# EAGLE design STUSB4500 (EAGLE 9.5.2)
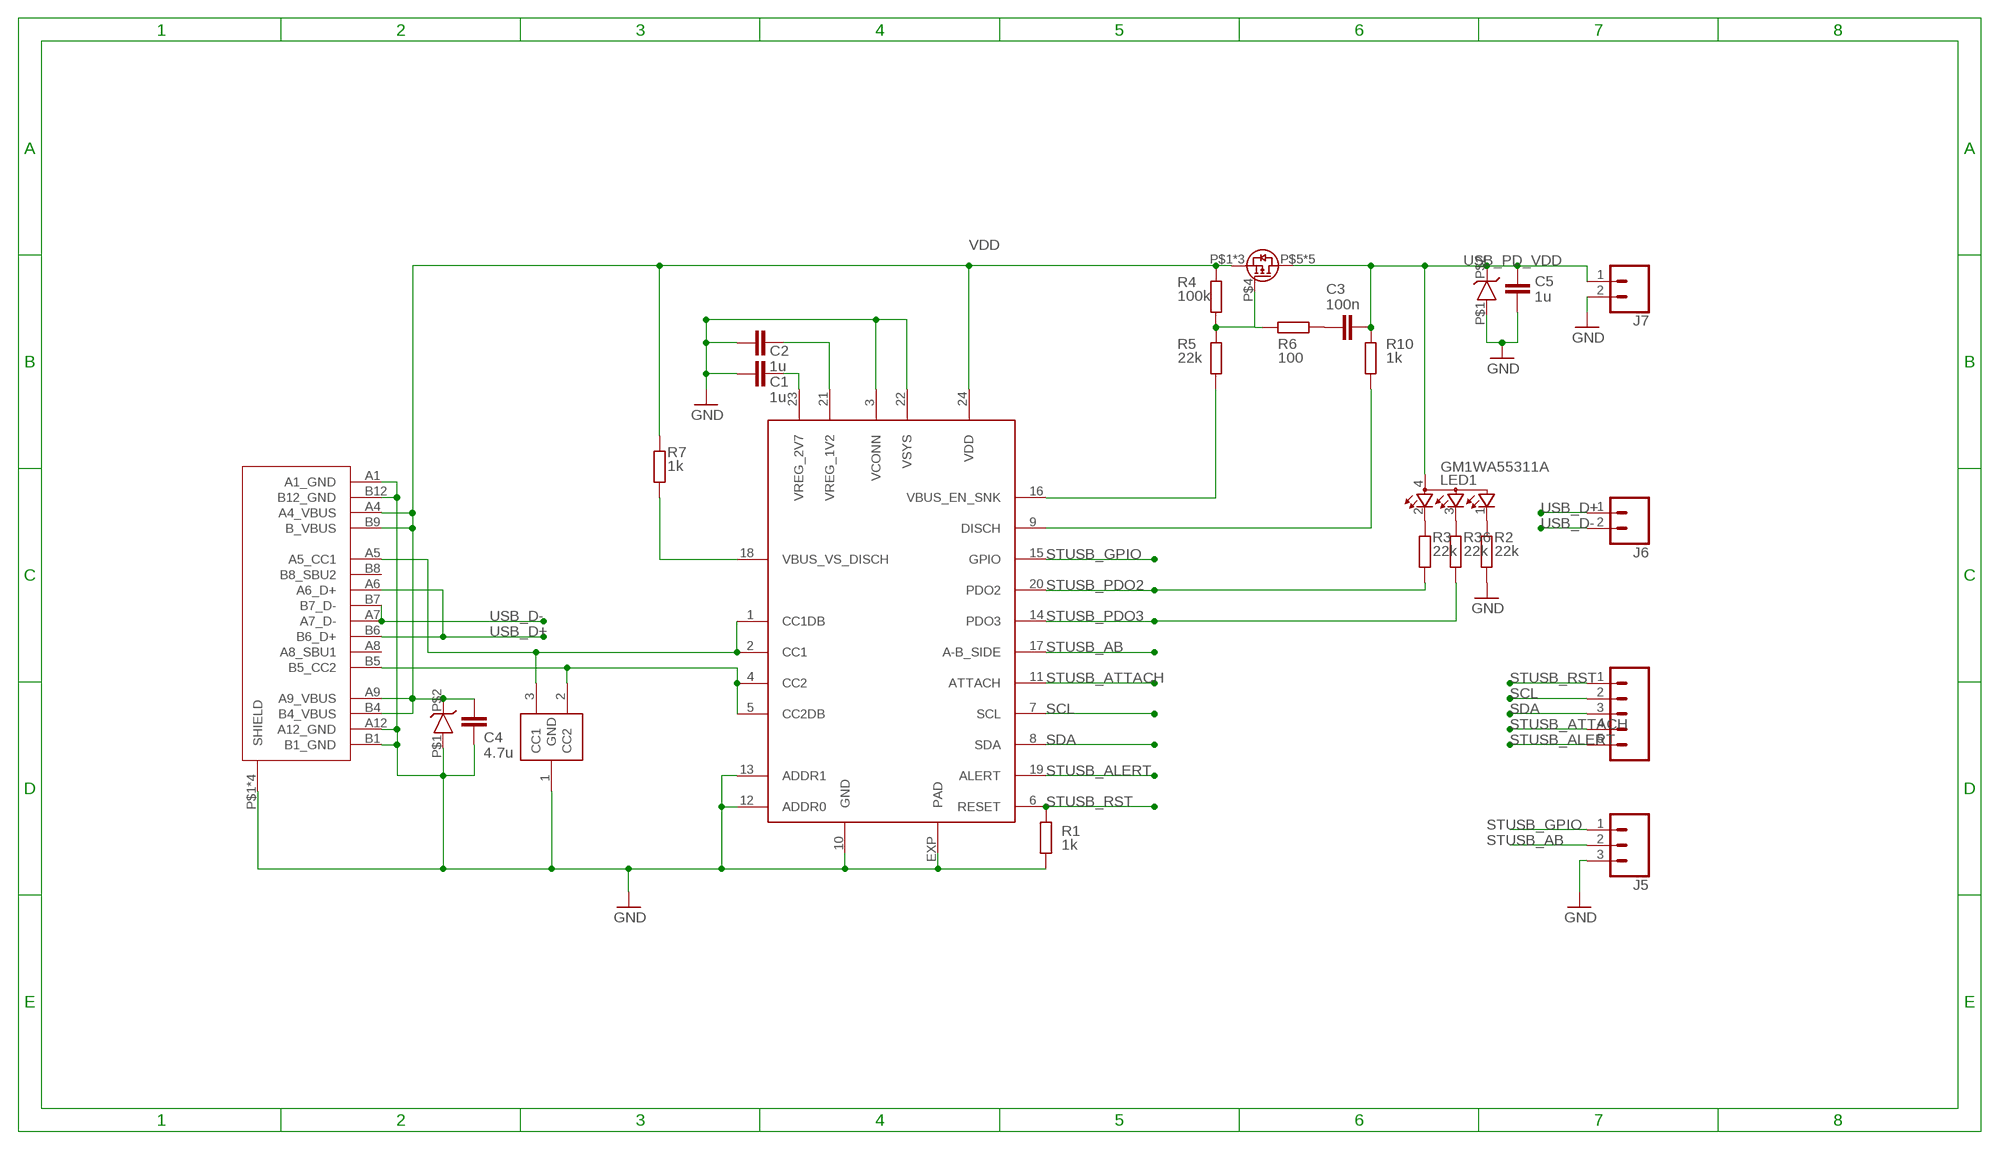
[diagram p0: schematic, sheet 1]

## Parts
C1  1u  C-EUC0402  [C0402]
C2  1u  C-EUC0402  [C0402]
C3  100n  C-EUC0402  [C0402]
C4  4.7u  C-EUC1206  [C1206]
C5  1u  C-EUC1206  [C1206]
ESDA25W  ESDA25WSOT323  [SOT323]
J5  CONN_031.27  [1X03_1.27MM]
J6  CONN_021.27  [1X02_1.27MM]
J7  CONN_02LOCK  [1X02_LOCK]
J8  CONN_051.27MM  [1X05_1.27MM]
LED1  GM1WA55311A  [GM1WA55311A]
R1  1k  R-EU_R0402  [R0402]
R2  22k  R-EU_R0402  [R0402]
R3  22k  R-EU_R0402  [R0402]
R4  100k  R-EU_R0402  [R0402]
R5  22k  R-EU_R0402  [R0402]
R6  100  R-EU_R0402  [R0402]
R7  1k  R-EU_R0402  [R0402]
R10  1k  R-EU_R0402  [R0402]
R36  22k  R-EU_R0402  [R0402]
U$1  STUSB4500QFN24_4X4  [QFN24-4X4]
U$2  USB-C  [USB-C_16P]
U$4  ESDA25P35  [1610]
U$5  ESDA25P35  [1610]
U$6  STL6P3LLH6  [POWER_FLAT_3X3]

## Nets
GND: C1.2 C2.2 C4.2 C5.2 ESDA25W.1(GND) J5.3 J7.2 R1.1 R2.1 U$1.3(VCONN) U$1.10(GND) U$1.12(ADDR0) U$1.13(ADDR1) U$1.22(VSYS) U$1.EXP(PAD) U$2.A1(A1_GND) U$2.A12(A12_GND) U$2.B1(B1_GND) U$2.B12(B12_GND) U$2.P$1(SHIELD) U$2.P$2(SHIELD) U$2.P$3(SHIELD) U$2.P$4(SHIELD) U$4.P$1(GND) U$5.P$1(GND)
N$2: LED1.1(CGREEN) R2.2
N$3: R4.1 R5.2 R6.2 U$6.P$4(G)
N$5: R7.2 U$1.18(VBUS_VS_DISCH)
N$6: LED1.2(CRED) R3.2
N$7: C3.1 R6.1
N$10: ESDA25W.3(CC1) U$1.1(CC1DB) U$1.2(CC1) U$2.A5(A5_CC1)
N$11: ESDA25W.2(CC2) U$1.4(CC2) U$1.5(CC2DB) U$2.B5(B5_CC2)
N$12: R5.1 U$1.16(VBUS_EN_SNK)
N$14: R10.2 U$1.9(DISCH)
N$16: C1.1 U$1.23(VREG_2V7)
N$17: C2.1 U$1.21(VREG_1V2)
N$20: LED1.3(CBLUE) R36.2
SCL: J8.2 U$1.7(SCL)
SDA: J8.3 U$1.8(SDA)
STUSB_AB: J5.2 U$1.17(A-B_SIDE)
STUSB_ALERT: J8.5 U$1.19(ALERT)
STUSB_ATTACH: J8.4 U$1.11(ATTACH)
STUSB_GPIO: J5.1 U$1.15(GPIO)
STUSB_PDO2: R3.1 U$1.20(PDO2)
STUSB_PDO3: R36.1 U$1.14(PDO3)
STUSB_RST: J8.1 R1.2 U$1.6(RESET)
USB_D+: J6.1 U$2.A6(A6_D+) U$2.B6(B6_D+)
USB_D-: J6.2 U$2.A7(A7_D-) U$2.B7(B7_D-)
USB_PD_VDD: C3.2 C5.1 J7.1 LED1.4(A) R10.1 U$5.P$2(VBUS) U$6.P$5(D) U$6.P$6(D) U$6.P$7(D) U$6.P$8(D) U$6.P$9(D)
VDD: C4.1 R4.2 R7.1 U$1.24(VDD) U$2.A4(A4_VBUS) U$2.A9(A9_VBUS) U$2.B4(B4_VBUS) U$2.B9(B_VBUS) U$4.P$2(VBUS) U$6.P$1(S) U$6.P$2(S) U$6.P$3(S)
Unconnected: U$2.A8(A8_SBU1) U$2.B8(B8_SBU2)

## Library data of the parts
C1-C5 = DD_rcl:C-EU: CAPACITOR, European symbol; SPICEPREFIX: C
ESDA25W = DD_STUSB4500:ESDA25W
J5 = DD_SparkFun-Connectors:CONN_03: Multi connection point. Often used as Generic Header-pin footprint for 0.1 inch spaced/style header connections On any of the 0.1 inch spaced packages, you can populate with these: Break Away Headers - Straight <https://www.sparkfun.com/products/116> (PRT-00116) Break Away Male Headers - Right Angle <https://www.sparkfun.com/products/553> (PRT-00553) Female Headers <https://www.sparkfun.com/products/115> (PRT-00115) Break Away Headers - Machine Pin <https://www.sparkfun.com/products/117> (PRT-00117) Break Away Female Headers - Swiss Machine Pin <https://www.sparkfun.com/products/743> (PRT-00743) Stackable Header - 3 Pin (Female, 0.1") <https://www.sparkfun.com/products/13875> (PRT-13875) For SCREWTERMINALS and SPRING TERMINALS visit here: Screw Terimnals on SparkFun.com <https://www.sparkfun.com/search/results?term=Screw+Terminals> (5mm/3.5mm/2.54mm spacing) This device is also useful as a general connection point to wire up your design to another part of your project. Our various solder wires solder well into these plated through hole pads. Hook-Up Wire - Assortment (Stranded, 22 AWG) <https://www.sparkfun.com/products/11375> (PRT-11375) Hook-Up Wire - Assortment (Solid Core, 22 AWG) <https://www.sparkfun.com/products/11367> (PRT-11367) View the entire wire category on our website here <https://www.sparkfun.com/categories/141> Special notes: Molex polarized connector foot print use with SKU : PRT-08232 with associated crimp pins and housings.
J6 J7 = DD_SparkFun-Connectors:CONN_02: Multi connection point. Often used as Generic Header-pin footprint for 0.1 inch spaced/style header connections On any of the 0.1 inch spaced packages, you can populate with these: Break Away Headers - Straight <https://www.sparkfun.com/products/116> (PRT-00116) Break Away Male Headers - Right Angle <https://www.sparkfun.com/products/553> (PRT-00553) Female Headers <https://www.sparkfun.com/products/115> (PRT-00115) Break Away Headers - Machine Pin <https://www.sparkfun.com/products/117> (PRT-00117) Break Away Female Headers - Swiss Machine Pin <https://www.sparkfun.com/products/743> (PRT-00743) For SCREWTERMINALS and SPRING TERMINALS visit here: Screw Terimnals on SparkFun.com <https://www.sparkfun.com/search/results?term=Screw+Terminals> (5mm/3.5mm/2.54mm spacing) This device is also useful as a general connection point to wire up your design to another part of your project. Our various solder wires solder well into these plated through hole pads. Hook-Up Wire - Assortment (Stranded, 22 AWG) <https://www.sparkfun.com/products/11375> (PRT-11375) Hook-Up Wire - Assortment (Solid Core, 22 AWG) <https://www.sparkfun.com/products/11367> (PRT-11367) View the entire wire category on our website here <https://www.sparkfun.com/categories/141> Special notes: Molex polarized connector foot print use with: PRT-08233 with associated crimp pins and housings. 2.54_SCREWTERM for use with PRT-10571. 3.5mm Screw Terminal footprints for PRT-08084 5mm Screw Terminal footprints for use with PRT-08432
J8 = DD_SparkFun-Connectors:CONN_05: Multi connection point. Often used as Generic Header-pin footprint for 0.1 inch spaced/style header connections On any of the 0.1 inch spaced packages, you can populate with these: Break Away Headers - Straight <https://www.sparkfun.com/products/116> (PRT-00116) Break Away Male Headers - Right Angle <https://www.sparkfun.com/products/553> (PRT-00553) Female Headers <https://www.sparkfun.com/products/115> (PRT-00115) Break Away Headers - Machine Pin <https://www.sparkfun.com/products/117> (PRT-00117) Break Away Female Headers - Swiss Machine Pin <https://www.sparkfun.com/products/743> (PRT-00743) For SCREWTERMINALS and SPRING TERMINALS visit here: Screw Terimnals on SparkFun.com <https://www.sparkfun.com/search/results?term=Screw+Terminals> (5mm/3.5mm/2.54mm spacing) This device is also useful as a general connection point to wire up your design to another part of your project. Our various solder wires solder well into these plated through hole pads. Hook-Up Wire - Assortment (Stranded, 22 AWG) <https://www.sparkfun.com/products/11375> (PRT-11375) Hook-Up Wire - Assortment (Solid Core, 22 AWG) <https://www.sparkfun.com/products/11367> (PRT-11367) View the entire wire category on our website here <https://www.sparkfun.com/categories/141> Special notes: Molex polarized connector foot print use with SKU : PRT-08231 with associated crimp pins and housings. 1MM SMD Version SKU: PRT-10208
LED1 = led:GM1WA55311A: Chip LED RGB Source: http://document.sharpsma.com/files/GM1WA55311A_SS.pdf
R1-R7 R10 R36 = DD_rcl:R-EU_: RESISTOR, European symbol; SPICEPREFIX: R
U$1 = DD_STUSB4500:STUSB4500
U$2 = DD_usb_c:USB-C
U$4 U$5 = DD_STUSB4500:ESDA25P35
U$6 = DD_STUSB4500:STL6P3LLH6

## Board
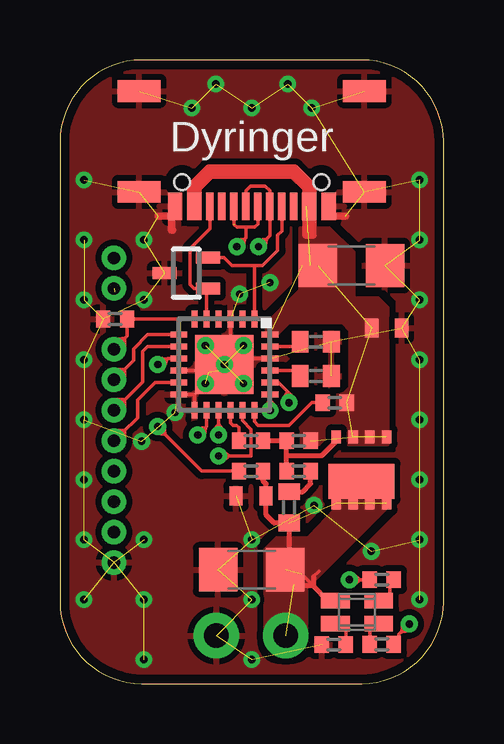
[diagram p1: board, top side]
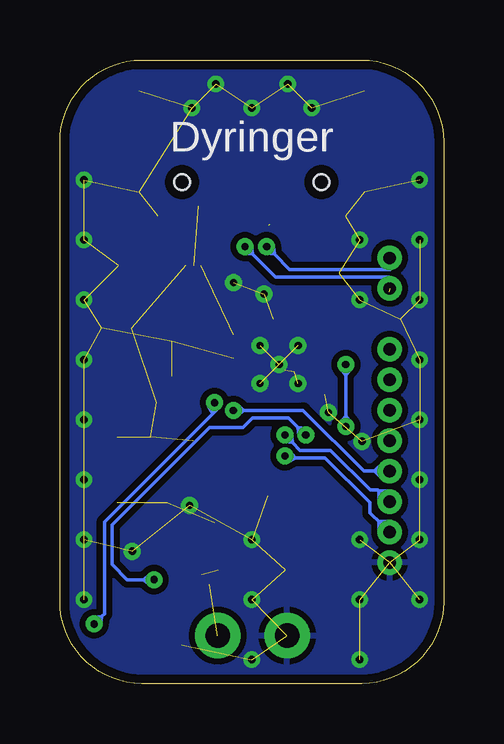
[diagram p2: board, bottom side, seen from below]

Size 16 x 26 mm. Coordinates in mm from the lower left corner, seen from the top.
Outline: 12.59,26 3.41,26 arc90 0,22.59 0,3.41 arc90 3.41,0 12.59,0 arc90 16,3.41 16,22.59 arc90 12.59,26
Copper layers (1*16): Top 0.035mm / dielectric 0.15mm / Bottom 0.035mm
Design rules "default *": minimum track width 6mil, minimum drill 0.35mm, track to track 6mil, track to pad 6mil, pad to pad 6mil, via to via 6mil, smd to smd 6mil, copper to edge 15mil, drill to drill 6mil, minimum pad ring 10mil, minimum via ring 8mil, stop-mask expansion 3mil, vias tented up to drill 20mil, thermal gap 10mil

### Footprints (pad centres in the part's own frame; a part is rotated, then mirrored left to right if it is on the bottom)
C0402 = smd 0.7 x 0.9: 1 -0.65,0; 2 0.65,0
C1206 = smd 1.6 x 1.8: 1 -1.4,0; 2 1.4,0
SOT323 = smd 0.5 x 1: 1 0,0.9; 2 -0.65,-0.9; 3 0.65,-0.9
1X03_1.27MM = drill 0.508 pad 1: 1 0,0; 2 1.27,0; 3 2.54,0
1X02_1.27MM = drill 0.508 pad 1: 1 0,0; 2 1.27,0
1X02_LOCK = drill 1.016 pad 1.88: 1 -0.178,0; 2 2.718,0
1X05_1.27MM = drill 0.508 pad 1: 1 0,0; 2 1.27,0; 3 2.54,0; 4 3.81,0; 5 5.08,0
GM1WA55311A = smd 0.65 x 1.2: 1 -0.475,0.9; 2 -0.475,-0.9; 3 0.475,-0.9; 4 0.475,0.9
R0402 = smd 0.6 x 0.7: 1 -0.5,0; 2 0.5,0
QFN24-4X4 = smd 0.7 x 0.25: 1 -1.9,1.25; 2 -1.9,0.75; 3 -1.9,0.25; 4 -1.9,-0.25; 5 -1.9,-0.75; 6 -1.9,-1.25; 13 1.9,-1.25; 14 1.9,-0.75; 15 1.9,-0.25; 16 1.9,0.25; 17 1.9,0.75; 18 1.9,1.25 | smd 0.25 x 0.7: 7 -1.25,-1.9; 8 -0.75,-1.9; 9 -0.25,-1.9; 10 0.25,-1.9; 11 0.75,-1.9; 12 1.25,-1.9; 19 1.25,1.9; 20 0.75,1.9; 21 0.25,1.9; 22 -0.25,1.9; 23 -0.75,1.9; 24 -1.25,1.9 | smd 2.45 x 2.45: EXP 0,0
USB-C_16P = smd 0.3 x 1.15: A1 -3.35,0.6; A4 -2.55,0.6; A5 -1.25,0.6; A6 -0.25,0.6; A7 0.25,0.6; A8 1.25,0.6; A9 2.55,0.6; A12 3.35,0.6; B1 3.05,0.6; B4 2.25,0.6; B5 1.75,0.6; B6 0.75,0.6; B7 -0.75,0.6; B8 -1.75,0.6; B9 -2.25,0.6; B12 -3.05,0.6 | smd 1.778 x 0.914: P$1 -4.7,-4.2; P$2 -4.7,0; P$3 4.7,0; P$4 4.7,-4.2 | hole 0.65: -2.9,-0.4; 2.9,-0.4
1610 = smd 0.55 x 0.8: P$1 0.625,0; P$2 -0.625,0
POWER_FLAT_3X3 = smd 0.4 x 0.55: P$1 -1.05,-0.95; P$2 -0.35,-0.95; P$3 0.35,-0.95; P$4 1.05,-0.95; P$5 -1.05,1.8; P$6 -0.35,1.8; P$7 0.35,1.8; P$8 1.05,1.8 | smd 2.75 x 1.47: P$9 0,0.9

### Placement (x,y rotation side)
C1  10.67,14.25 0 top
C2  10.67,12.82 0 top
C3  9.56,7.35 270 top
C4  12.16,17.43 0 top
C5  8,4.75 180 top
ESDA25W  5.27,17.11 90 top
J5  2.25,7.58 270 top
J6  2.25,17.75 270 top
J7  9.24,2 180 top
J8  2.25,13.94 270 top
LED1  12.39,2.98 90 top
R1  2.3,15.2 0 top
R2  11.42,1.62 0 top
R3  13.42,1.63 180 top
R4  9.95,10.12 0 top
R5  7.97,10.12 0 top
R6  9.95,8.86 180 top
R7  11.46,11.71 180 top
R10  7.97,8.86 180 top
R36  13.42,4.33 0 top
U$1  6.86,13.3 270 top
U$2  8,20.5 180 top
U$4  13.63,14.82 0 top
U$5  7.97,7.82 180 top
U$6  12.57,9.33 180 top

### Tracks (layer width: path | path; a pad name or v marks a point on that pad's centre or on a via)
GND  (via drill 0.3)  (57 unrouted)
  Top 0.152: 6.22,12.98 6.16,13.05 U$1.10 | U$1.22 7.23,13.55 | 7.23,13.55 7.11,13.55 7.11,13.67 | U$1.3 7.11,13.67 | 6.61,13.05 U$1.EXP | U$1.13 5.61,12.05 | U$1.12 5.61,12.05 | 5.61,12.05 5.75,12.19 | 5.75,12.19 v6.06,12.51 | 5.75,12.19 | 5.75,12.19 6.1,12.23 | 6.1,12.23 | 5.75,12.19 | 5.75,12.19 5.79,12.54 | 5.79,12.54 | 5.75,12.19 6.1,12.23 | 6.1,12.23 | v6.06,12.51 6.1,12.23 | 5.75,12.19 5.79,12.54 | v6.06,12.51 5.79,12.54 | 5.75,12.19 6.1,12.23 | v6.06,12.51 6.1,12.23 | 5.75,12.19 5.79,12.54 | v6.06,12.51 5.79,12.54 | 7.23,13.55 | 7.23,13.55 6.88,13.58 | 6.88,13.58 | U$1.EXP 6.88,13.58 | 7.23,13.55 7.12,13.21 | 7.23,13.55 6.88,13.58 | U$1.EXP 6.88,13.58 | 7.23,13.55 7.12,13.21 | U$1.EXP 7.12,13.21 | 7.11,13.67 6.77,13.56 | 7.11,13.67 | 7.11,13.67 7.13,13.32 | U$1.EXP 7.13,13.32 | 7.11,13.67 6.77,13.56 | U$1.EXP 6.77,13.56 | 7.11,13.67 7.13,13.32 | U$1.EXP 7.13,13.32
  Top 0.305: U$2.B12 U$2.A1 11.35,19.5 11.9,19.5 | U$2.A12 U$2.B1 | U$2.A12 4.65,19.5 4.1,19.5 | U$2.A12 4.65,18.9 4.7,18.9
  other vias: 7.49,16.24 5.5,24 8,24 10.5,24 1,21 1,18.5 1,16 1,13.5 1,11 1,8.5 1,6 15,21 15,18.5 15,16 15,13.5 15,11 15,8.5 15,6 15,3.5 1,3.5 6.06,14.09 7.65,12.51 7.65,14.09 3.4,10.1 8,1 6.86,13.3 3.5,18.5 3.5,16 8.76,16.71 8,3.5 8,6 3.5,3.5 3.5,1 3.5,6 6.5,25 9.5,25 12.98,5.52 10.6,7.42 4.8,11.3
  pour Top (isolate 0.254, rank 2): 0,26 0,-0.01 16,-0.01 16,26
  pour Bottom (isolate 0.254, rank 2): 0,-0.01 0,26 16,26 16,-0.01
N$2
  Top 0.152: 11.84,1.7 R2.2 11.92,2.28 11.69,2.51 LED1.1
N$3
  Top 0.152: U$6.P$4 11.52,10.11
  Top 0.2: R6.2 9.45,9.49 | 9.45,9.49 R4.1 R5.2 | 11.52,10.11 10.91,9.49 9.45,9.49
N$5
  Top 0.152: U$1.18 8.11,10.92 8.27,10.77 9.56,10.77 10.51,11.71 R7.2
N$6
  Top 0.152: R3.2 12.92,2.31 13.09,2.31 LED1.2
N$7
  Top 0.2: C3.1 10.13,8 10.45,8.32 R6.1
N$10
  Top 0.152: U$1.2 U$1.1 8.11,17.43 | 8.11,17.43 8.45,17.43 9.08,18.06 9.08,18.7 9.25,18.87 U$2.A5 | 8.11,17.43 7.18,17.43 6.84,17.76 ESDA25W.3
N$11
  Top 0.152: U$1.5 6.06,15.24 | 6.06,16.46 5.6,16.46 5.43,16.63 5.43,18.14 6.25,18.96 U$2.B5 | 6.06,16.46 ESDA25W.2 | U$1.5 6.11,16.42 6.06,16.46 | U$1.4 U$1.5
N$12
  Top 0.152: U$1.16 7.11,10.87 7.21,10.76 7.37,10.76 7.47,10.67 R5.1
N$14  (via drill 0.3)
  Top 0.152: U$1.9 4.49,13.55 4.47,13.53 | 4.47,13.53 4.24,13.3 v4.08,13.3 | R10.2 5.91,8.86 4.38,10.38 | v4.08,10.72 4.08,10.69 4.38,10.38 | 4.47,13.53 4.12,13.57 v4.08,13.3 | 4.47,13.53 4.34,13.2 v4.08,13.3 | 4.38,10.38 4.35,10.74 v4.08,10.72 | 4.38,10.38 4.03,10.44 v4.08,10.72
  Bottom 0.152: v4.08,10.72 4.08,11.17 | 4.08,11.17 | 4.08,11.17 4.08,12.85 | 4.08,12.85 v4.08,13.3 | 4.08,12.85 4.3,13.13 v4.08,13.3 | 4.08,12.85 3.86,13.13 v4.08,13.3 | 4.08,11.17 | 4.08,11.17 3.86,10.89 | 4.08,11.17 4.3,10.89 | 4.08,11.17 3.86,10.89 | v4.08,10.72 3.86,10.89 | 4.08,11.17 4.3,10.89 | v4.08,10.72 4.3,10.89 | 4.08,11.17 3.86,10.89 | v4.08,10.72 3.86,10.89 | 4.08,11.17 4.3,10.89 | v4.08,10.72 4.3,10.89
N$16
  Top 0.152: C1.1 9.82,14.05 U$1.23
N$17
  Top 0.152: C2.1 9.79,13.05 U$1.21
N$20
  Top 0.152: R36.2 13.92,4.26 13.75,4.09 13.75,3.73 13.47,3.46 LED1.3
SCL
  Top 0.152: U$1.7 3.67,14.55 3.07,13.96 3.07,13.46 2.62,13.02 J8.2
  Top 0.305: 2.62,13.02 2.25,13.02 J8.2 2.6,12.66 2.62,13.02
SDA
  Top 0.152: U$1.8 3.66,14.05 3.46,13.85 3.46,12.58 J8.3
  Top 0.305: 2.61,11.75 2.25,11.75 J8.3 2.61,11.39 2.61,11.75
STUSB_AB  (via drill 0.3)
  Top 0.152: U$1.17 7.61,10.96 7.97,10.6 7.97,9.49 7.07,9.49 | 7.07,9.49 | 7.07,9.49 v6.62,9.49 | 7.07,9.49 6.79,9.71 | 7.07,9.49 | 7.07,9.49 6.79,9.27 | 7.07,9.49 6.79,9.71 | v6.62,9.49 6.79,9.71 | 7.07,9.49 6.79,9.27 | v6.62,9.49 6.79,9.27 | 7.07,9.49 6.79,9.71 | v6.62,9.49 6.79,9.71 | 7.07,9.49 6.79,9.27 | v6.62,9.49 6.79,9.27
  Bottom 0.152: v6.62,9.49 6.54,9.41 6.18,9.41 | 6.18,9.41 4.94,9.41 3.07,7.54 3.07,7.11 2.62,6.67 J5.2 | 6.18,9.41 6.49,9.24 v6.62,9.49 | 6.18,9.41 6.41,9.68 v6.62,9.49
  Bottom 0.305: 2.62,6.67 2.25,6.67 J5.2 2.6,6.3 2.62,6.67
STUSB_ALERT  (via drill 0.3)
  Top 0.152: U$1.19 8.77,11.83 | 8.77,11.83 | 8.77,11.83 v8.77,11.38 | 8.77,11.83 | 8.77,11.83 8.55,11.55 | 8.77,11.83 8.98,11.55 | 8.77,11.83 8.55,11.55 | v8.77,11.38 8.55,11.55 | 8.77,11.83 8.98,11.55 | v8.77,11.38 8.98,11.55 | 8.77,11.83 8.55,11.55 | v8.77,11.38 8.55,11.55 | 8.77,11.83 8.98,11.55 | v8.77,11.38 8.98,11.55
  Bottom 0.152: v8.77,11.38 8.77,11.39 8.32,11.39 | 8.32,11.39 5.86,11.39 3.32,8.86 2.76,8.86 J8.5 | 8.32,11.39 8.59,11.17 v8.77,11.38 | 8.32,11.39 8.6,11.61 v8.77,11.38
  Bottom 0.305: 2.76,8.86 2.5,9.11 J8.5 2.5,8.6 2.76,8.86
STUSB_ATTACH
  Top 0.152: U$1.11 3.96,12.55 3.23,11.82 3.23,11.08 2.61,10.48 J8.4
  Top 0.305: 2.61,10.48 2.25,10.48 J8.4 2.6,10.12 2.61,10.48
STUSB_GPIO  (via drill 0.3)
  Top 0.152: U$1.15 6.61,10.81 | 6.61,10.81 6.61,10.38 v6.62,10.36 | 6.61,10.81 6.4,10.53 v6.62,10.36 | 6.61,10.81 6.83,10.54 v6.62,10.36
  Bottom 0.152: v6.62,10.36 6.3,10.04 | 6.3,10.04 5.99,9.73 4.72,9.73 3.06,8.06 2.74,8.06 2.61,7.94 J5.1 | 6.3,10.04 | 6.3,10.04 6.65,10.09 | 6.65,10.09 | 6.3,10.04 | 6.3,10.04 6.34,10.4 | 6.34,10.4 | 6.3,10.04 6.65,10.09 | 6.65,10.09 | v6.62,10.36 6.65,10.09 | 6.3,10.04 6.34,10.4 | v6.62,10.36 6.34,10.4 | 6.3,10.04 6.65,10.09 | v6.62,10.36 6.65,10.09 | 6.3,10.04 6.34,10.4 | v6.62,10.36 6.34,10.4
  Bottom 0.305: 2.61,7.94 2.25,7.94 J5.1 2.61,7.58 2.61,7.94
STUSB_PDO2  (via drill 0.3)
  Top 0.152: U$1.20 9.12,12.55 9.51,12.16 | v9.56,11.71 9.56,12.11 9.51,12.16 | v14.57,2.48 14.25,2.17 | R3.1 14.14,1.85 14.14,2.06 14.25,2.17 | 14.25,2.17 14.27,2.17 14.6,2.21 | 9.51,12.16 9.32,11.86 v9.56,11.71 | 9.51,12.16 9.76,11.91 v9.56,11.71 | 14.25,2.17 | 14.25,2.17 14.6,2.21 | 14.6,2.21 | 14.25,2.17 | 14.25,2.17 14.29,2.52 | 14.29,2.52 | 14.25,2.17 14.6,2.21 | 14.6,2.21 | v14.57,2.48 14.6,2.21 | 14.25,2.17 14.29,2.52 | v14.57,2.48 14.29,2.52 | 14.25,2.17 14.6,2.21 | v14.57,2.48 14.6,2.21 | 14.25,2.17 14.29,2.52 | v14.57,2.48 14.29,2.52
  Bottom 0.152: 9.61,11.27 14.14,6.74 14.14,2.92 14.25,2.8 | 9.61,11.27 9.56,11.32 v9.56,11.71 | v14.57,2.48 14.25,2.8 | 14.25,2.8 | 9.61,11.27 9.79,11.57 v9.56,11.71 | 9.61,11.27 9.36,11.52 v9.56,11.71 | 14.25,2.8 | 14.25,2.8 14.29,2.45 | 14.29,2.45 | 14.25,2.8 14.6,2.76 | 14.6,2.76 | 14.25,2.8 14.29,2.45 | 14.29,2.45 | v14.57,2.48 14.29,2.45 | 14.25,2.8 | 14.25,2.8 14.6,2.76 | v14.57,2.48 14.6,2.76 | 14.25,2.8 14.29,2.45 | v14.57,2.48 14.29,2.45 | 14.25,2.8 14.6,2.76 | v14.57,2.48 14.6,2.76
STUSB_PDO3  (via drill 0.3)
  Top 0.152: U$1.14 6.11,10.72 6.07,10.68 | 6.07,10.68 | 6.07,10.68 v5.75,10.36 | R36.1 12.52,4.33 | 12.52,4.33 | 12.52,4.33 v12.07,4.33 | 6.07,10.68 5.71,10.64 | 5.71,10.64 | 6.07,10.68 6.02,10.33 | 6.02,10.33 | 5.71,10.64 | v5.75,10.36 5.71,10.64 | 6.07,10.68 6.02,10.33 | v5.75,10.36 6.02,10.33 | 6.07,10.68 5.71,10.64 | v5.75,10.36 5.71,10.64 | 6.07,10.68 6.02,10.33 | v5.75,10.36 6.02,10.33 | 12.52,4.33 12.24,4.55 | 12.52,4.33 | 12.52,4.33 12.24,4.11 | 12.52,4.33 12.24,4.55 | v12.07,4.33 12.24,4.55 | 12.52,4.33 12.24,4.11 | v12.07,4.33 12.24,4.11 | 12.52,4.33 12.24,4.55 | v12.07,4.33 12.24,4.55 | 12.52,4.33 12.24,4.11 | v12.07,4.33 12.24,4.11
  Bottom 0.152: v12.07,4.33 12.52,4.33 | 12.52,4.33 | 12.52,4.33 13.2,4.33 13.83,4.97 13.83,6.61 9.76,10.68 8.37,10.68 7.97,11.08 6.46,11.08 6.07,10.68 | 6.07,10.68 | 6.07,10.68 v5.75,10.36 | 6.07,10.68 5.71,10.64 | 5.71,10.64 | 6.07,10.68 6.02,10.33 | 6.02,10.33 | 5.71,10.64 | v5.75,10.36 5.71,10.64 | 6.07,10.68 6.02,10.33 | v5.75,10.36 6.02,10.33 | 6.07,10.68 5.71,10.64 | v5.75,10.36 5.71,10.64 | 6.07,10.68 6.02,10.33 | v5.75,10.36 6.02,10.33 | 12.52,4.33 12.24,4.55 | 12.52,4.33 | 12.52,4.33 12.24,4.11 | 12.52,4.33 12.24,4.55 | v12.07,4.33 12.24,4.55 | 12.52,4.33 12.24,4.11 | v12.07,4.33 12.24,4.11 | 12.52,4.33 12.24,4.55 | v12.07,4.33 12.24,4.55 | 12.52,4.33 12.24,4.11 | v12.07,4.33 12.24,4.11
STUSB_RST
  Top 0.152: U$1.6 R1.2 2.8,14.48 2.61,14.29 J8.1
  Top 0.305: 2.61,14.29 2.25,14.29 J8.1 2.61,13.93 2.61,14.29
USB_D+  (via drill 0.3)  (1 unrouted)
  Top 0.152: 7.18,19.64 U$2.B6 7.25,19.15 | U$2.A6 8.25,19.15 8.12,19.02 7.75,19.02 | 7.75,19.02 7.38,19.02 7.28,19.12 | 7.75,19.02 7.75,18.6 7.7,18.54 | 7.7,18.54 v7.38,18.22 | 7.7,18.54 7.34,18.5 v7.38,18.22 | 7.7,18.54 7.65,18.19 v7.38,18.22
  Bottom 0.152: v7.38,18.22 7.06,17.9 | 7.06,17.9 6.43,17.27 2.25,17.27 J6.1 | 7.06,17.9 | 7.06,17.9 7.41,17.95 | 7.41,17.95 | 7.06,17.9 | 7.06,17.9 7.1,18.25 | 7.1,18.25 | 7.06,17.9 7.41,17.95 | 7.41,17.95 | v7.38,18.22 7.41,17.95 | 7.06,17.9 7.1,18.25 | v7.38,18.22 7.1,18.25 | 7.06,17.9 7.41,17.95 | v7.38,18.22 7.41,17.95 | 7.06,17.9 7.1,18.25 | v7.38,18.22 7.1,18.25
USB_D-  (via drill 0.3)  (1 unrouted)
  Top 0.152: U$2.A7 7.75,20.55 7.94,20.74 8.56,20.74 8.75,20.55 U$2.B7 8.75,18.68 8.61,18.54 | 8.61,18.54 | 8.61,18.54 v8.29,18.22 | 8.61,18.54 8.25,18.5 | 8.25,18.5 | 8.61,18.54 8.56,18.19 | 8.56,18.19 | 8.25,18.5 | v8.29,18.22 8.25,18.5 | 8.61,18.54 8.56,18.19 | v8.29,18.22 8.56,18.19 | 8.61,18.54 8.25,18.5 | v8.29,18.22 8.25,18.5 | 8.61,18.54 8.56,18.19 | v8.29,18.22 8.56,18.19
  Bottom 0.152: v8.29,18.22 7.97,17.9 | 7.97,17.9 7.02,16.95 2.28,16.95 2.28,16.32 | 7.97,17.9 | 7.97,17.9 8.32,17.95 | 8.32,17.95 | 7.97,17.9 | 7.97,17.9 8.01,18.25 | 8.01,18.25 | 7.97,17.9 8.32,17.95 | 8.32,17.95 | v8.29,18.22 8.32,17.95 | 7.97,17.9 8.01,18.25 | v8.29,18.22 8.01,18.25 | 7.97,17.9 8.32,17.95 | v8.29,18.22 8.32,17.95 | 7.97,17.9 8.01,18.25 | v8.29,18.22 8.01,18.25
USB_PD_VDD  (6 unrouted)
  Top 0.152: 9.56,4.99 C5.1 | LED1.4 11.19,3.46 | 10.09,4.55 10.57,4.07 | U$6.P$9 12.92,8.08 U$6.P$6 | 10.57,4.46 10.79,4.68 | 9.82,4.07 9.76,4.13
  Top 0.2: R10.1 8.47,8.45 8.59,8.33 U$5.P$2 8.59,7.04 8.94,6.7 C3.2 9.56,4.99 | 11.19,3.46 10.57,4.07 | 10.57,4.46 10.57,4.07 | 10.57,4.07 9.82,4.07
  pour Top (no thermals): 11.46,7.58 13.68,7.58 13.68,7.37 10.27,3.96 10.27,1.99 arc-91 9.4,1.14 arc-89 8.55,2 8.55,5.6 9.03,6.08 10.35,6.08 10.43,6.16 11.46,7.27
VDD  (8 unrouted)
  Top 0.254: 10.12,17.43 C4.1 10.42,17.43
  Top 0.305: U$2.A9 U$2.B4 5.75,20.65 6.3,21.2 9.7,21.2 10.25,20.65 U$2.B9 10.25,18.7 10.55,18.7 U$2.A4 10.55,20.75 9.8,21.5 6.2,21.5 5.45,20.75 U$2.A9 | U$2.A9 5.55,20
  pour Top (isolate 0.254, no thermals): 13.68,9.97 9.56,9.97 9.56,10.44 10.35,11.24 11.46,11.24 11.46,12.09 11.84,12.09 12.1,12.35 12.1,14.73 11.78,15.05 9.56,15.05 9.08,14.57 8.6,14.57 8.6,15.01 10.01,16.41 10,19 11.22,19.02 12.26,17.98 12.26,16.08 13.29,16.08 13.68,15.68

### Text on the board
tPlace: Dyringer
bPlace: Dyringer